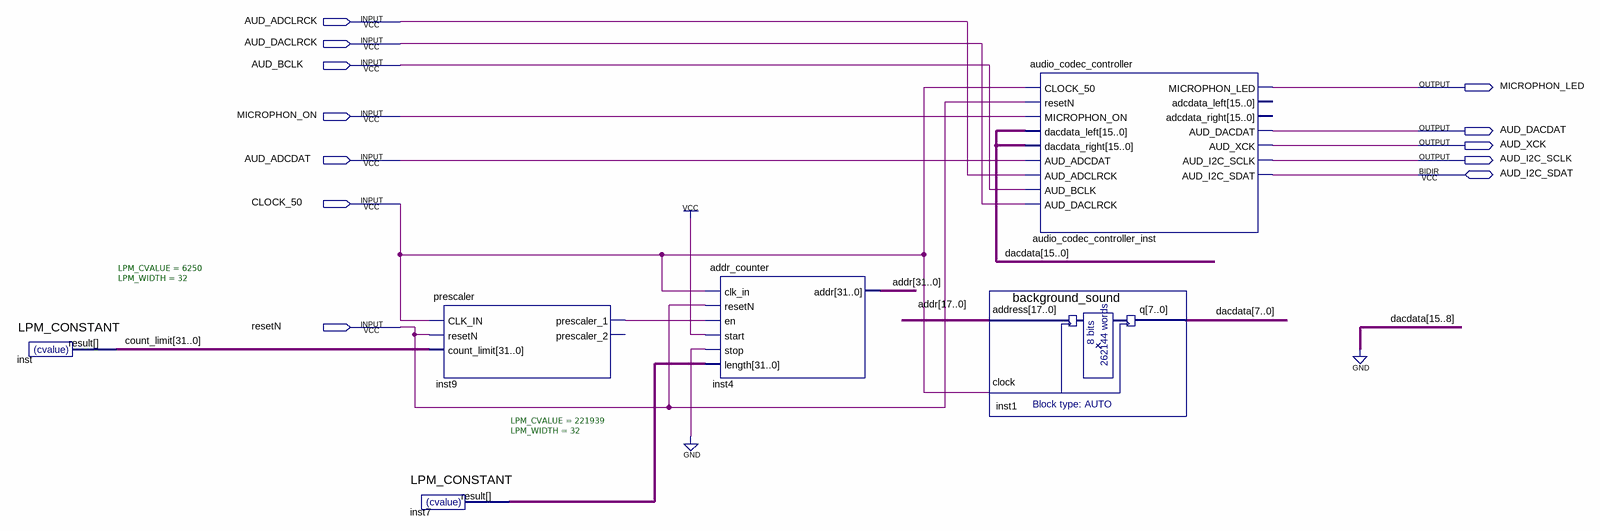
[diagram p0: schematic sheet]
// Quartus schematic experiment_sinus_generator.bdf as structural Verilog: 6 symbols, 12 pins
module experiment_sinus_generator (
  input  AUD_ADCLRCK,
  input  AUD_DACLRCK,
  input  AUD_BCLK,
  input  MICROPHON_ON,
  input  AUD_ADCDAT,
  input  CLOCK_50,
  input  resetN,
  inout  AUD_I2C_SDAT,
  output MICROPHON_LED,
  output AUD_DACDAT,
  output AUD_XCK,
  output AUD_I2C_SCLK
);

  wire inst9_prescaler_1;
  wire [7:0] dacdata;
  wire [31:0] addr, count_limit, inst7_result;

  LPM_CONSTANT #(.LPM_CVALUE(6250), .LPM_WIDTH(32)) inst (.result(count_limit));
  prescaler inst9 (
    .CLK_IN(CLOCK_50), .resetN(resetN), .count_limit(count_limit), .prescaler_1(inst9_prescaler_1));  // open: prescaler_2
  LPM_CONSTANT #(.LPM_CVALUE(221939), .LPM_WIDTH(32)) inst7 (.result(inst7_result));
  addr_counter inst4 (
    .clk_in(CLOCK_50), .resetN(resetN), .en(inst9_prescaler_1), .start(1'b1), .stop(1'b0),
    .length(inst7_result), .addr(addr));
  audio_codec_controller audio_codec_controller_inst (
    .CLOCK_50(CLOCK_50), .resetN(resetN), .MICROPHON_ON(MICROPHON_ON), .dacdata_left({{8{1'b0}}, dacdata}),
    .dacdata_right({{8{1'b0}}, dacdata}), .AUD_ADCDAT(AUD_ADCDAT), .AUD_ADCLRCK(AUD_ADCLRCK),
    .AUD_BCLK(AUD_BCLK), .AUD_DACLRCK(AUD_DACLRCK), .MICROPHON_LED(MICROPHON_LED), .AUD_DACDAT(AUD_DACDAT),
    .AUD_XCK(AUD_XCK), .AUD_I2C_SCLK(AUD_I2C_SCLK), .AUD_I2C_SDAT(AUD_I2C_SDAT));  // open: adcdata_left, adcdata_right
  background_sound inst1 (.address(addr[17:0]), .clock(CLOCK_50), .q(dacdata));
endmodule
